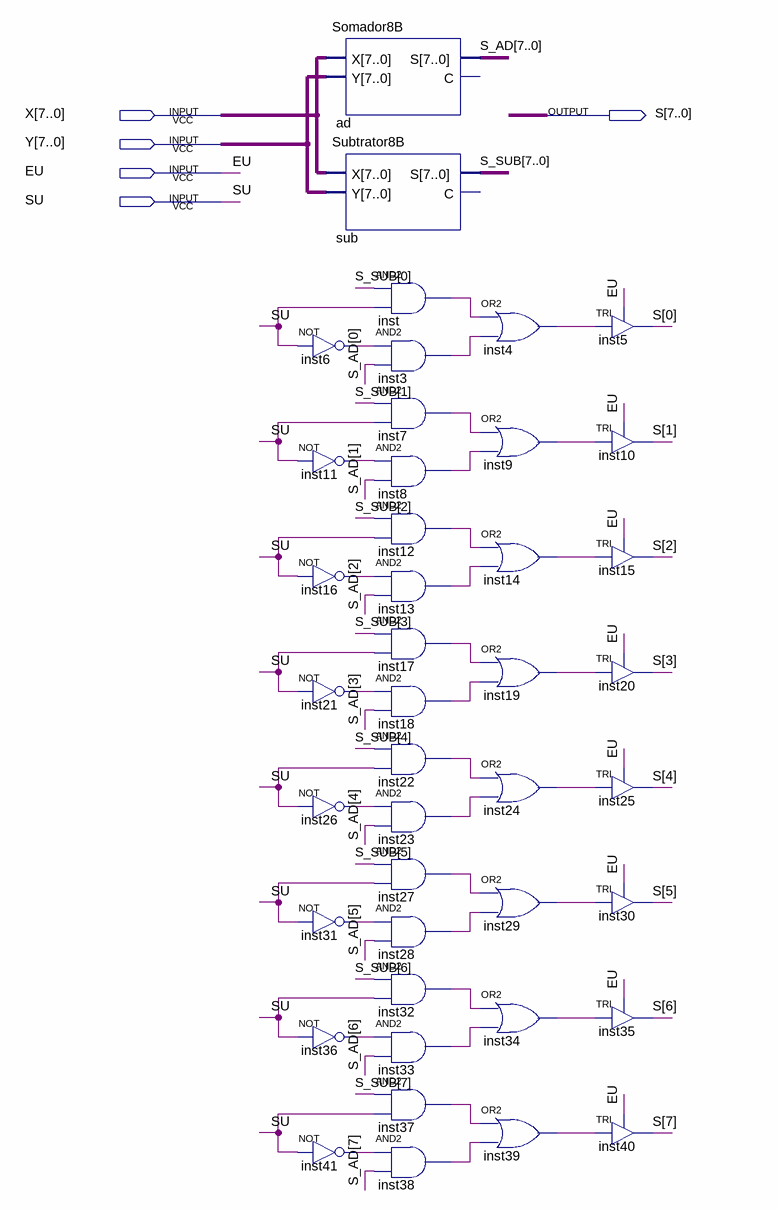
[diagram p0: schematic sheet]
// Quartus schematic Somador_Subtrator.bdf as structural Verilog: 42 symbols, 5 pins
module Somador_Subtrator (
  input  [7:0] X,
  input  [7:0] Y,
  input  EU,
  input  SU,
  output [7:0] S
);

  wire inst3_out, inst4_out, inst6_out, inst7_out, inst8_out, inst9_out, inst11_out, inst12_out, inst13_out,
       inst14_out, inst16_out, inst17_out, inst18_out, inst19_out, inst21_out, inst22_out, inst23_out,
       inst24_out, inst26_out, inst27_out, inst28_out, inst29_out, inst31_out, inst32_out, inst33_out,
       inst34_out, inst36_out, inst37_out, inst38_out, inst39_out, inst41_out, inst_out;
  wire [7:0] S_AD, S_SUB;

  Somador8B ad (.X(X), .Y(Y), .S(S_AD));  // open: C
  Subtrator8B sub (.X(X), .Y(Y), .S(S_SUB));  // open: C
  not inst6 (inst6_out, SU);
  not inst11 (inst11_out, SU);
  not inst16 (inst16_out, SU);
  not inst21 (inst21_out, SU);
  not inst26 (inst26_out, SU);
  not inst31 (inst31_out, SU);
  not inst36 (inst36_out, SU);
  not inst41 (inst41_out, SU);
  and inst (inst_out, S_SUB[0], SU);
  and inst3 (inst3_out, inst6_out, S_AD[0]);
  and inst7 (inst7_out, S_SUB[1], SU);
  and inst8 (inst8_out, inst11_out, S_AD[1]);
  and inst12 (inst12_out, S_SUB[2], SU);
  and inst13 (inst13_out, inst16_out, S_AD[2]);
  and inst17 (inst17_out, S_SUB[3], SU);
  and inst18 (inst18_out, inst21_out, S_AD[3]);
  and inst22 (inst22_out, S_SUB[4], SU);
  and inst23 (inst23_out, inst26_out, S_AD[4]);
  and inst27 (inst27_out, S_SUB[5], SU);
  and inst28 (inst28_out, inst31_out, S_AD[5]);
  and inst32 (inst32_out, S_SUB[6], SU);
  and inst33 (inst33_out, inst36_out, S_AD[6]);
  and inst37 (inst37_out, S_SUB[7], SU);
  and inst38 (inst38_out, inst41_out, S_AD[7]);
  or inst4 (inst4_out, inst_out, inst3_out);
  or inst9 (inst9_out, inst7_out, inst8_out);
  or inst14 (inst14_out, inst12_out, inst13_out);
  or inst19 (inst19_out, inst17_out, inst18_out);
  or inst24 (inst24_out, inst22_out, inst23_out);
  or inst29 (inst29_out, inst27_out, inst28_out);
  or inst34 (inst34_out, inst32_out, inst33_out);
  or inst39 (inst39_out, inst37_out, inst38_out);
  TRI inst5 (.IN(inst4_out), .OE(EU), .OUT(S[0]));
  TRI inst10 (.IN(inst9_out), .OE(EU), .OUT(S[1]));
  TRI inst15 (.IN(inst14_out), .OE(EU), .OUT(S[2]));
  TRI inst20 (.IN(inst19_out), .OE(EU), .OUT(S[3]));
  TRI inst25 (.IN(inst24_out), .OE(EU), .OUT(S[4]));
  TRI inst30 (.IN(inst29_out), .OE(EU), .OUT(S[5]));
  TRI inst35 (.IN(inst34_out), .OE(EU), .OUT(S[6]));
  TRI inst40 (.IN(inst39_out), .OE(EU), .OUT(S[7]));
endmodule
